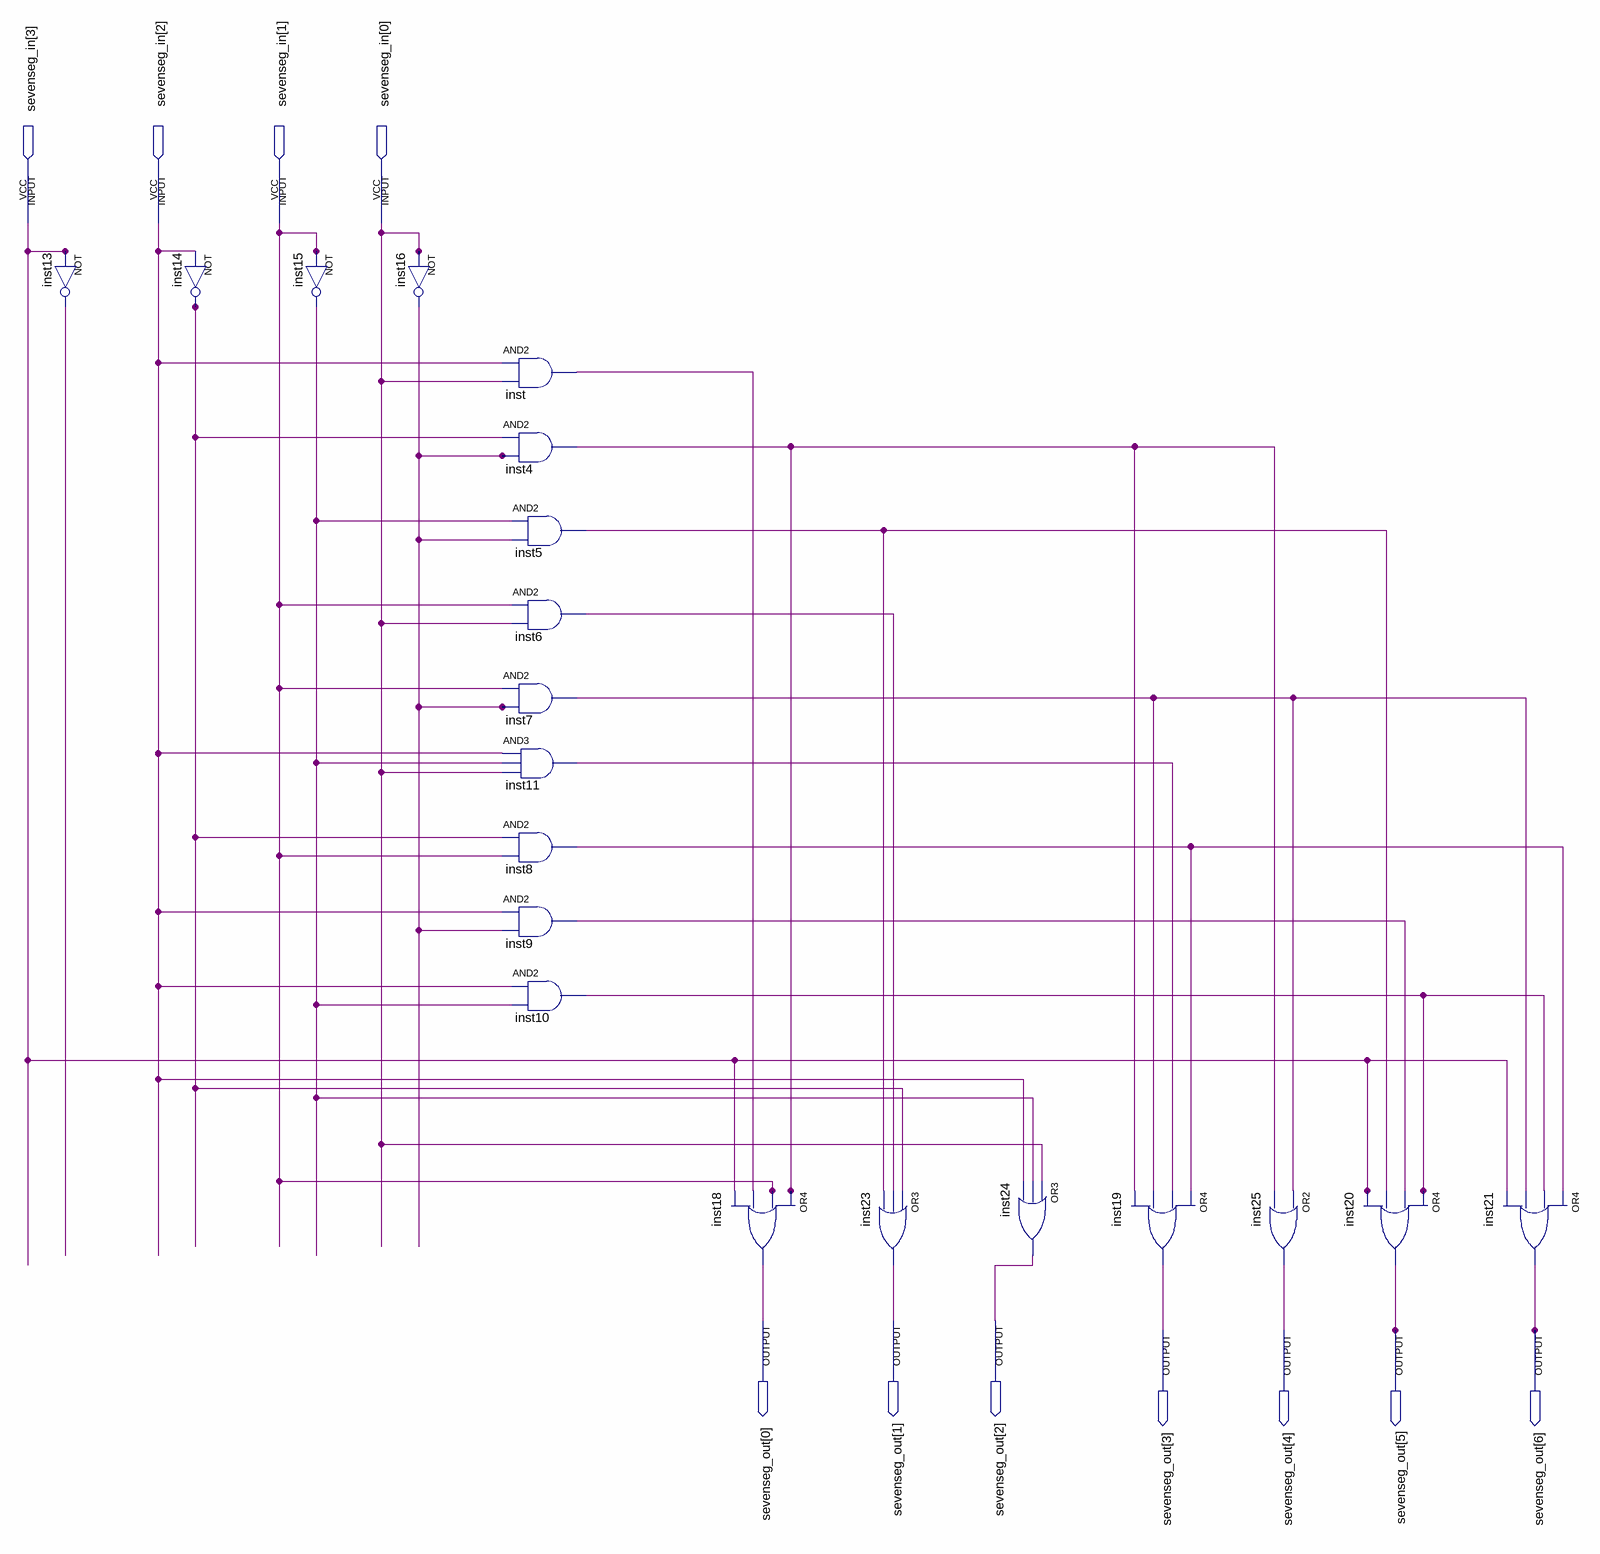
[diagram p0: schematic sheet]
// Quartus schematic sevenseg.bdf as structural Verilog: 20 symbols, 11 pins
module sevenseg (
  input  [3:0] sevenseg_in,
  output [6:0] sevenseg_out
);

  wire inst4_out, inst5_out, inst6_out, inst7_out, inst8_out, inst9_out, inst10_out, inst11_out, inst13_out,
       inst14_out, inst15_out, inst16_out, inst_out;

  not inst13 (inst13_out, sevenseg_in[3]);
  not inst14 (inst14_out, sevenseg_in[2]);
  not inst15 (inst15_out, sevenseg_in[1]);
  not inst16 (inst16_out, sevenseg_in[0]);
  and inst (inst_out, sevenseg_in[2], sevenseg_in[0]);
  and inst4 (inst4_out, inst14_out, inst16_out);
  and inst5 (inst5_out, inst15_out, inst16_out);
  and inst6 (inst6_out, sevenseg_in[1], sevenseg_in[0]);
  and inst7 (inst7_out, sevenseg_in[1], inst16_out);
  and inst11 (inst11_out, sevenseg_in[2], inst15_out, sevenseg_in[0]);
  and inst8 (inst8_out, inst14_out, sevenseg_in[1]);
  and inst9 (inst9_out, sevenseg_in[2], inst16_out);
  and inst10 (inst10_out, sevenseg_in[2], inst15_out);
  or inst18 (sevenseg_out[0], inst4_out, sevenseg_in[1], inst_out, sevenseg_in[3]);
  or inst23 (sevenseg_out[1], inst14_out, inst6_out, inst5_out);
  or inst24 (sevenseg_out[2], sevenseg_in[0], inst15_out, sevenseg_in[2]);
  or inst19 (sevenseg_out[3], inst8_out, inst11_out, inst7_out, inst4_out);
  or inst25 (sevenseg_out[4], inst7_out, inst4_out);
  or inst20 (sevenseg_out[5], inst10_out, inst9_out, inst5_out, sevenseg_in[3]);
  or inst21 (sevenseg_out[6], inst8_out, inst10_out, inst7_out, sevenseg_in[3]);
endmodule
